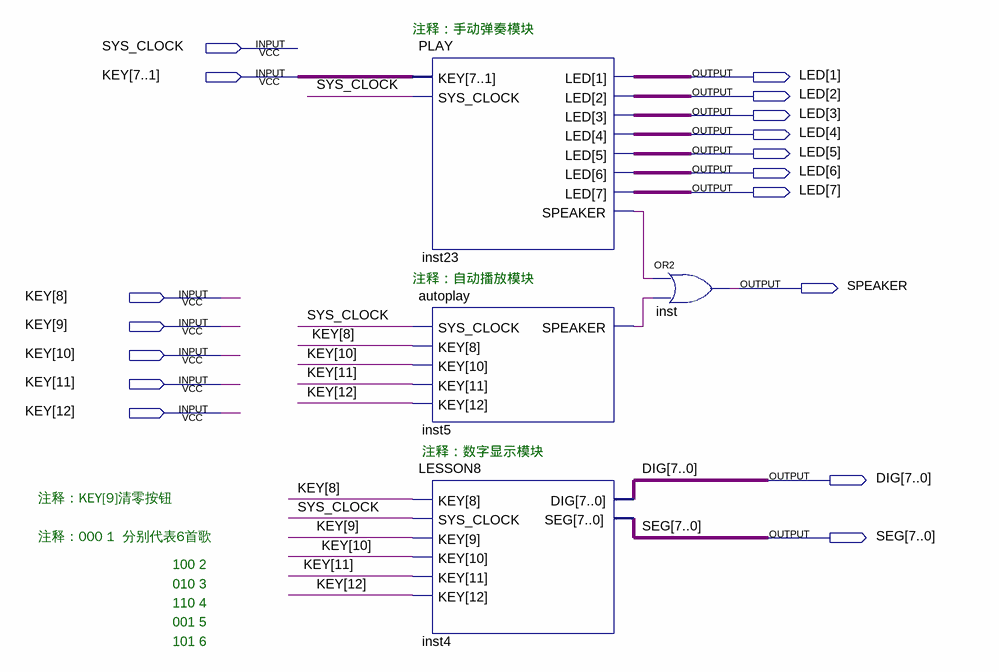
[diagram p0: schematic sheet]
// Quartus schematic SHIXIAN.bdf as structural Verilog: 4 symbols, 17 pins
module SHIXIAN (
  input  SYS_CLOCK,
  input  [12:1] KEY,
  output [7:1] LED,
  output SPEAKER,
  output [7:0] DIG,
  output [7:0] SEG
);

  wire inst5_speaker, inst23_speaker;

  PLAY inst23 (.KEY(KEY[7:1]), .SYS_CLOCK(SYS_CLOCK), .LED(LED), .SPEAKER(inst23_speaker));
  autoplay inst5 (.SYS_CLOCK(SYS_CLOCK), .KEY({KEY[12:10], KEY[8]}), .SPEAKER(inst5_speaker));
  LESSON8 inst4 (.KEY(KEY[12:8]), .SYS_CLOCK(SYS_CLOCK), .DIG(DIG), .SEG(SEG));
  or inst (SPEAKER, inst23_speaker, inst5_speaker);

  // Notes on the sheet:
  //   注释：手动弹奏模块
  //   注释：自动播放模块
  //   注释：数字显示模块
  //   注释：KEY[9]清零按钮
  //   注释：000 1  分别代表6首歌
  //   100 2
  //   010 3
  //   110 4
  //   001 5
  //   101 6
endmodule
